# Altium project Carte_design.PrjPcb (part 2 of 2)

## Sheet WAN.SchDoc
size A4
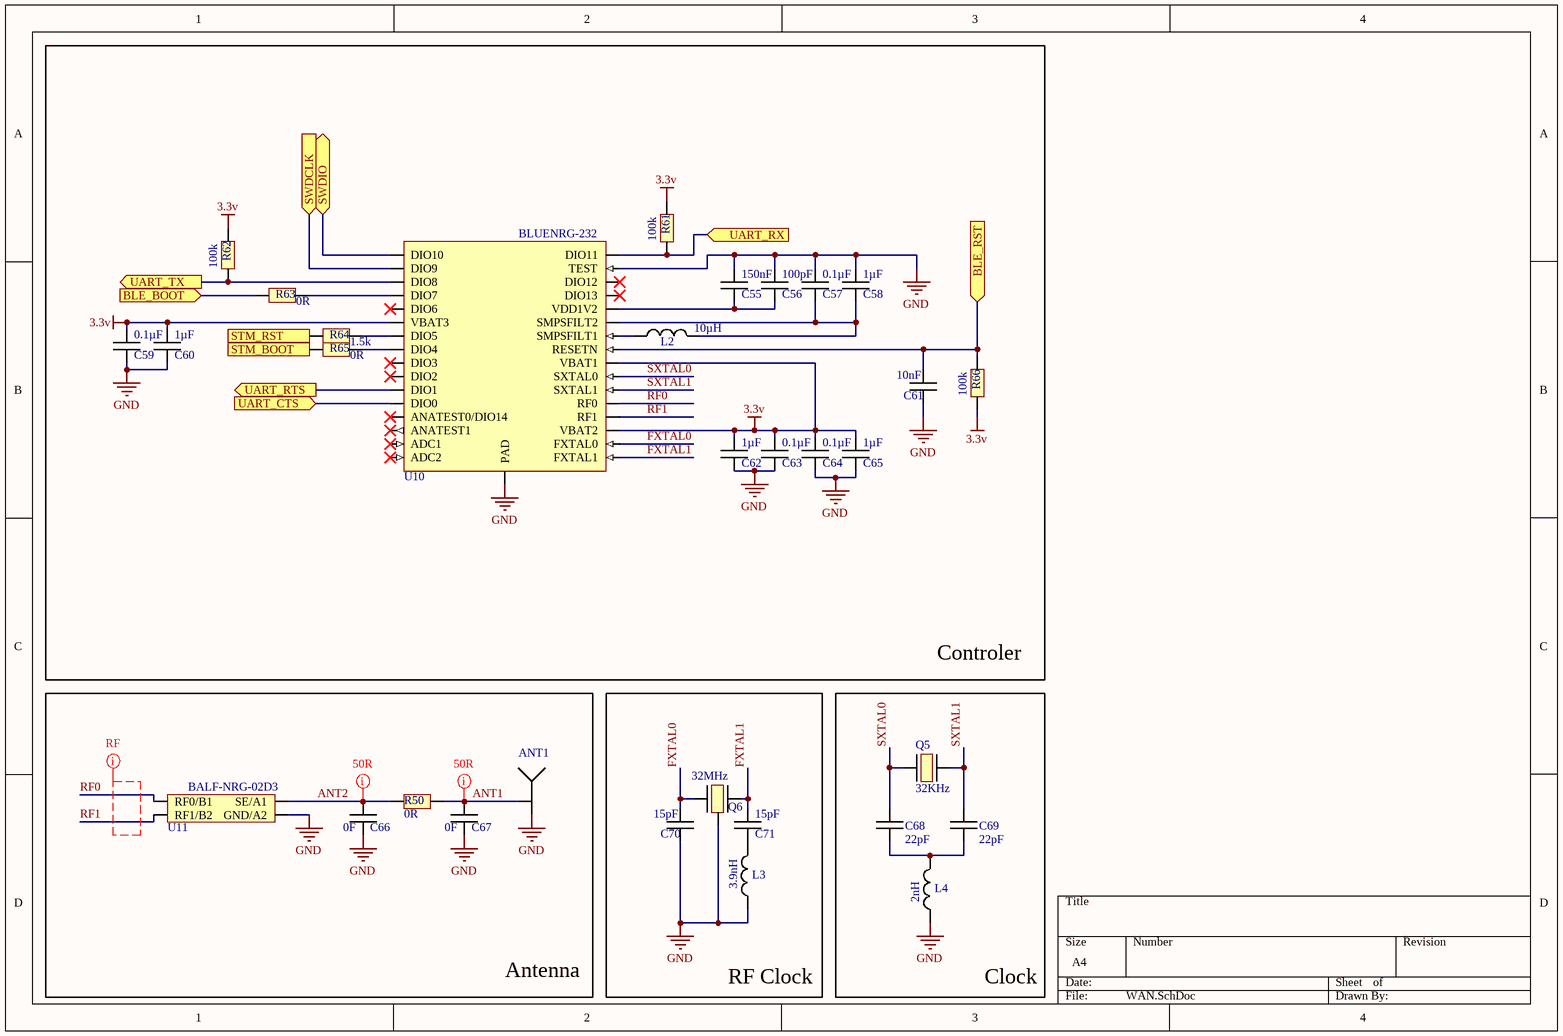
[diagram p4: WAN.SchDoc]

### Parts
ANT1  UFL  [UFL]  (value not drawn)
C55  150nF  [0603]
C56  100pF  [0603]
C57  0.1µF  [0603]
C58  1µF  [0603]
C59  0.1µF  [0603]
C60  1µF  [0603]
C61  10nF  [0603]
C62  1µF  [0603]
C63  0.1µF  [0603]
C64  0.1µF  [0603]
C65  1µF  [0603]
C66  0F  [0603]
C67  0F  [0603]
C68  22pF  [0603]
C69  22pF  [0603]
C70  15pF  [0603]
C71  15pF  [0603]
L2  10µH  [0603]
L3  3.9nH  [0402]
L4  2nH  [0603]
Q5  32KHz  [BLE_Quartz_Sxtal]
Q6  32MHz  [BLE_Quartz_Fxtal]
R50  0R  [0603]
R61  100k  [0603]
R62  100k  [0603]
R63  0R  [0603]
R64  1.5k  [0603]
R65  0R  [0603]
R66  100k  [0603]
U10  BLUENRG-232  [QFN50P500X500X100_HS-33M]
U11  BALF-NRG-02D3  [4-UFBGA]

### Blocks framed on the sheet
Controler: C55-C65 L2 R61-R66 U10
Antenna: ANT1 C66 C67 R50 U11
RF Clock: C70 C71 L3 Q6
Clock: C68 C69 L4 Q5

### Ports
BLE_BOOT (in), BLE_RST (in), STM_BOOT (out), STM_RST (out), SWDCLK (in), SWDIO (bidir), UART_CTS (in), UART_RTS (out), UART_RX (in), UART_TX (out)

### Nets
3.3v: C59.2 C60.2 C62.2 C63.2 C64.2 C65.2 R61.2 R62.2 R66.1 U10.6(VBAT3) U10.19(VBAT2) U10.24(VBAT1)
GND: ANT1.2(GND) C55.2 C56.2 C57.2 C58.2 C59.1 C60.1 C61.1 C62.1 C63.1 C64.1 C65.1 C66.1 C67.1 C70.1 L3.1 L4.1 Q6.3 U10.31(TEST) U10.33(PAD) U11.2(GND/A2)
ANT1: ANT1.1(GND) C67.2 R50.2
ANT2: C66.2 R50.1 U11.1(SE/A1)
FXTAL0: C70.2 Q6.1 U10.18(FXTAL0)
FXTAL1: C71.2 Q6.2 U10.17(FXTAL1)
RF0: U10.21(RF0) U11.3(RF0/B1)
RF1: U10.20(RF1) U11.4(RF1/B2)
RST1: R64.2 ; port STM_RST
RST2: C61.2 R66.2 U10.25(RESETN) ; port BLE_RST
SWCLK2: U10.2(DIO9) ; port SWDCLK
SWDIO2: U10.1(DIO10) ; port SWDIO
SXTAL0: C68.2 Q5.2 U10.23(SXTAL0)
SXTAL1: C69.2 Q5.1 U10.22(SXTAL1)
NetC55_1: C55.1 C56.1 U10.28(VDD1V2)
NetC57_1: C57.1 C58.1 L2.2 U10.27(SMPSFILT2)
NetC68_1: C68.1 C69.1 L4.2
NetC71_1: C71.1 L3.2
NetL2_1: L2.1 U10.26(SMPSFILT1)
NetR61_1: R61.1 U10.32(DIO11) ; port UART_RX
NetR62_1: R62.1 U10.3(DIO8) ; port UART_TX
NetR63_1: R63.1 U10.4(DIO7)
NetR63_2: R63.2 ; port BLE_BOOT
NetR64_1: R64.1 U10.7(DIO5)
NetR65_1: R65.1 U10.8(DIO4)
NetR65_2: R65.2 ; port STM_BOOT
NetU10_11: U10.11(DIO1) ; port UART_RTS
NetU10_12: U10.12(DIO0) ; port UART_CTS

Not connected (* = marked no-connect by the designer): U10 5(DIO6)* 9(DIO3)* 10(DIO2)* 13(ANATEST0/DIO14)* 14(ANATEST1)* 15(ADC1)* 16(ADC2)* 29(DIO13)* 30(DIO12)*

### Layout directives
rule Length Constraint [Min Length = 0.7mm    Max Length = 0.9mm]: (no net found under the mark)
rule Width Constraint [Pref Width = 0.25mm    Min Width = 0.25mm    Max Width = 0.25mm]; rule Clearance Constraint [Clearance = 0.2mm]; net class 50R: ANT1, ANT2

### Library data of the parts
ANT1 = UFL: Manufacturer 1: Hirose; Manufacturer Part Number 1: U.FL-R-SMT-1(40); Body Material: Bronze; Body Plating: Silver; Dielectric Material: Polymer; Impedance: 50R; Connector Type: Coaxial,Receptacle,Male Pin; Max Frequency: 6GHz; Polarity: Standard; Insulation Resistance: 500MR; Gender: Female; Supplier 1: Mouser; Stock 1: 562; Pricing 1: 1=1,14000, 10=0,93600, 100=0,85900, 250=0,78000, 500=0,71600, 1000=0,62400, 4000=0,54600, 8000=0,50800 (USD); RoHS: Yes; Mount: Surface Mount; Contact Material: Brass,Bronze; Contact Plating: Gold; Housing Color: Beige; Min Operating Temperature: -40°C; Max Operating Temperature: 90°C; Package Quantity: 4000; Packaging: Tape and Reel; Fastening Type: Snap; Termination: Solder; Frequency: 6GHz; Orientation: Vertical; Lead Free: Lead Free; ComponentLink1URL: https://datasheet.ciiva.com/18563/uflseries-18563675.pdf?src-supplier=Digi-Key; ComponentLink1Description: https://datasheet.ciiva.com/18563/uflseries-18563675.pdf?src-supplier=Digi-Key; Supplier Part Number 1: 798-UFLRSMT140
C55-C71 = Capa
L2 = Self: Manufacturer 1: TDK; Manufacturer Part Number 1: MLZ1608M100WT; Core Material: Ferrite; Tolerance: 20%; Self Resonant Frequency: 17MHz; Shielding: Shielded; Inductance: 10uH; Max DC Current: 250mA; DC Resistance (DCR): 1.05R; Test Frequency: 2MHz; DC Current: 90mA; Supplier 1: Farnell; Supplier Part Number 1: 2215635; Stock 1: 796; Pricing 1: 10=0,13600, 100=0,09360, 500=0,07170, 1000=0,05980, 2000=0,05180, 4000=0,04090, 20000=0,03940 (EUR); RoHS: Yes; Mount: Surface Mount; Case/Package: 603; Case Code (Metric): 1608; Case Code (Imperial): 0603; Min Operating Temperature: -55°C; Max Operating Temperature: 125°C; Packaging: Cut Tape; Inductance Tolerance: 20%; Military Standard: Not; Length: 1.75mm; Depth: 0.95mm; REACH SVHC: No SVHC; ComponentLink1URL: https://datasheet.ciiva.com/8045/1649095-8045526.pdf?src-supplier=Element14; ComponentLink1Description: https://datasheet.ciiva.com/8045/1649095-8045526.pdf?src-supplier=Element14
L3 = self2: Manufacturer 1: Murata; Manufacturer Part Number 1: LQG15WZ3N9S02D; Core Material: Air; Current Rating: 900mA; Shielding: Unshielded; DC Resistance (DCR): 90mR; Self Resonant Frequency: 5GHz; Test Frequency: 100MHz; Supplier 1: Digi-Key; Supplier Part Number 1: 490-15282-1-ND; Stock 1: 7036; Pricing 1: 1=0,15000, 10=0,13500, 100=0,08970, 500=0,07476, 1000=0,06279, 2500=0,05382 (USD); RoHS: No; Mount: Surface Mount; Case/Package: 0402; Case Code (Imperial): 0402; Case Code (Metric): 1005; Min Operating Temperature: -55°C; Max Operating Temperature: 125°C; Packaging: Cut Tape; Inductance: 3.9nH; Ratings: AEC-Q200; ComponentLink1URL: http://search.murata.co.jp/Ceramy/image/img/P02/JELF243B-9117.pdf?src-supplier=Digi-Key; ComponentLink1Description: http://search.murata.co.jp/Ceramy/image/img/P02/JELF243B-9117.pdf?src-supplier=Digi-Key
L4 = Self: Manufacturer 1: Murata; Manufacturer Part Number 1: BLM18GG471SN1D; Core Material: Ferrite; Material: Steel,Ferrite; Max Current Rating: 200mA; Impedance: 470R; Tolerance: 25%; Number of Lines: 1; Resistance: 1.3R; DC Resistance (DCR): 300mR; Test Frequency: 100MHz; Supplier 1: Digi-Key; Supplier Part Number 1: 490-5981-1-ND; Stock 1: 23621; Pricing 1: 1=0,27000, 10=0,20600, 25=0,17080, 50=0,14740, 100=0,13270, 250=0,11204, 500=0,10024, 1000=0,08549 (USD); RoHS: Yes; Case/Package: 0603; Number of Pins: 2; Case Code (Metric): 1608; Case Code (Imperial): 0603; Contact Plating: Tin,Matte; Min Operating Temperature: -55°C; Max Operating Temperature: 125°C; Package Quantity: 1; Packaging: Tape and Reel; Current Rating: 200mA; Max DC Current: 200mA; Termination: Flat; Number of Circuits: 1; Length: 1.6mm; Height: 0.8mm; Width: 0.8mm; Depth: 0.8mm; REACH SVHC: No SVHC; Lead Free: Lead Free; ComponentLink1URL: https://datasheet.ciiva.com/3067/l0110s0105blm18g-3067184.pdf?src-supplier=Avnet; ComponentLink1Description: https://datasheet.ciiva.com/3067/l0110s0105blm18g-3067184.pdf?src-supplier=Avnet; ComponentLink2URL: https://datasheet.ciiva.com/11800/0900766b811b5866-11800884.pdf?src-supplier=RSComponents; ComponentLink2Description: https://datasheet.ciiva.com/11800/0900766b811b5866-11800884.pdf?src-supplier=RSComponents; ComponentLink3URL: https://datasheet.ciiva.com/1467/5170-1467240.pdf?src-supplier=Element14; ComponentLink3Description: https://datasheet.ciiva.com/1467/5170-1467240.pdf?src-supplier=Element14; ComponentLink4URL: https://datasheet.ciiva.com/27747/1844951-27747823.pdf?src-supplier=Jameco; ComponentLink4Description: https://datasheet.ciiva.com/27747/1844951-27747823.pdf?src-supplier=Jameco; ComponentLink5URL: https://datasheet.ciiva.com/41449/001171701-da-01-en-chip-drossel0603-470r-200ma-1-6x0-8mm-41449377.pdf?src-supplier=Conrad; ComponentLink5Description: https://datasheet.ciiva.com/41449/001171701-da-01-en-chip-drossel0603-470r-200ma-1-6x0-8mm-41449377.pdf?src-supplier=Conrad; ComponentLink6URL: https://datasheet.ciiva.com/41449/001172271-da-01-en-drossel-0603-470r-1-6x0-8mm-4000st-41449611.pdf?src-supplier=Conrad; ComponentLink6Description: https://datasheet.ciiva.com/41449/001172271-da-01-en-drossel-0603-470r-1-6x0-8mm-4000st-41449611.pdf?src-supplier=Conrad; ComponentLink7URL: https://datasheet.ciiva.com/6211/l0110e-6211878.pdf?src-supplier=Digi-Key; ComponentLink7Description: https://datasheet.ciiva.com/6211/l0110e-6211878.pdf?src-supplier=Digi-Key; ComponentLink8URL: https://datasheet.ciiva.com/6211/l0110e-6211879.pdf?src-supplier=Digi-Key; ComponentLink8Description: https://datasheet.ciiva.com/6211/l0110e-6211879.pdf?src-supplier=Digi-Key; ComponentLink9URL: https://datasheet.ciiva.com/14122/blm-series-eng-tds-14122875.pdf?src-supplier=Distrelec; ComponentLink9Description: https://datasheet.ciiva.com/14122/blm-series-eng-tds-14122875.pdf?src-supplier=Distrelec
Q5 = BLE_quartz_Sxtal: Manufacturer 1: NDK; Manufacturer Part Number 1: NX2012SA-32.768K-STD-MUB-1; Frequency: 32.768kHz; Load Capacitance: 12.5pF; ESR (Equivalent Series Resistance): 80kR; Frequency Tolerance: 20ppm; Supplier 1: Digi-Key; Stock 1: 28609; Pricing 1: 1=0,91000, 10=0,80500, 50=0,75200, 100=0,66460, 500=0,62964, 1000=0,52470 (USD); RoHS: Yes; Mount: Surface Mount; Case/Package: SMD/SMT; Min Operating Temperature: -40°C; Max Operating Temperature: 85°C; Packaging: Tape and Reel; Length: 0.081inch; Height: 0.024inch; Width: 0.047inch; ComponentLink1URL: http://www.ndk.com/images/products/catalog/c_NX2012SA-STD-MUB-1_e.pdf?src-supplier=Digi-Key; ComponentLink1Description: http://www.ndk.com/images/products/catalog/c_NX2012SA-STD-MUB-1_e.pdf?src-supplier=Digi-Key; Supplier Part Number 1: 644-1219-1-ND
Q6 = BLE_Quartz_Fxtal: Manufacturer 1: Kyocera AVX; Manufacturer Part Number 1: CX2016DB32000D0FLJCC; Load Capacitance: 8pF; ESR (Equivalent Series Resistance): 80R; Frequency Tolerance: 10ppm; Frequency Stability: 15ppm; Supplier 1: Digi-Key; Stock 1: 89937; Pricing 1: 1=0,94000, 10=0,83500, 50=0,78040, 100=0,68970, 500=0,65340, 1000=0,54450 (USD); RoHS: Yes; Mount: Surface Mount; Case/Package: SMD/SMT; Number of Pins: 4; Min Operating Temperature: -30°C; Max Operating Temperature: 85°C; Frequency: 32MHz; Packaging: Tape and Reel; Package Quantity: 3000; Tolerance: 10ppm; Termination: SMD/SMT; Series Resistance: 80R; Length: 0.079inch; Height: 0.018inch; Width: 1.6mm; Lead Pitch: 1.4mm; REACH SVHC: No SVHC; ComponentLink1URL: https://datasheet.ciiva.com/29631/cx2016db-wl-e-29631269.pdf?src-supplier=Digi-Key; ComponentLink1Description: https://datasheet.ciiva.com/29631/cx2016db-wl-e-29631269.pdf?src-supplier=Digi-Key; ComponentLink2URL: https://datasheet.ciiva.com/29631/cx2016db-wl-e-29631270.pdf?src-supplier=Digi-Key; ComponentLink2Description: https://datasheet.ciiva.com/29631/cx2016db-wl-e-29631270.pdf?src-supplier=Digi-Key; ComponentLink3URL: https://datasheet.ciiva.com/29631/cx2016db-wl-e-29631271.pdf?src-supplier=Digi-Key; ComponentLink3Description: https://datasheet.ciiva.com/29631/cx2016db-wl-e-29631271.pdf?src-supplier=Digi-Key; Supplier Part Number 1: 1253-1118-1-ND
R50 R61-R66 = Resistance
U10 = BLUENRG-232: Manufacturer 1: STMicroelectronics; Supplier 1: Farnell; Manufacturer Part Number 1: BLUENRG-232; Stock 1: 3489; Pricing 1: 1=3,54000, 10=2,68000, 25=2,55000, 50=2,44000, 100=2,32000, 250=2,20000, 500=1,98000, 1000=1,64000 (EUR); RoHS: No; ComponentLink1URL: http://www.farnell.com/datasheets/2327324.pdf?src-supplier=Farnell; ComponentLink1Description: http://www.farnell.com/datasheets/2327324.pdf?src-supplier=Farnell; ComponentLink2URL: https://www.st.com/resource/en/flyer/flbluenrg21017.pdf?src-supplier=Digi-Key; ComponentLink2Description: https://www.st.com/resource/en/flyer/flbluenrg21017.pdf?src-supplier=Digi-Key; ComponentLink3URL: http://www.farnell.com/datasheets/2327324.pdf?src-supplier=Newark; ComponentLink3Description: http://www.farnell.com/datasheets/2327324.pdf?src-supplier=Newark; Supplier Part Number 1: 2771347
U11 = Balf: Manufacturer 1: STMicroelectronics; Supplier 1: Digi-Key; Manufacturer Part Number 1: BALF-NRG-02D3; Stock 1: 10182; Pricing 1: 1=0,40000, 10=0,34700, 100=0,25870, 500=0,20328, 1000=0,15708 (USD); RoHS: No; ComponentLink1URL: http://www.farnell.com/datasheets/2342732.pdf?src-supplier=Farnell; ComponentLink1Description: http://www.farnell.com/datasheets/2342732.pdf?src-supplier=Farnell; ComponentLink2URL: http://www.st.com/content/ccc/resource/technical/document/datasheet/group3/51/4f/c4/19/79/13/4a/ad/DM00408204/files/DM00408204.pdf/jcr:content/translations/en.DM00408204.pdf?src-supplier=Digi-Key; ComponentLink2Description: http://www.st.com/content/ccc/resource/technical/document/datasheet/group3/51/4f/c4/19/79/13/4a/ad/DM00408204/files/DM00408204.pdf/jcr:content/translations/en.DM00408204.pdf?src-supplier=Digi-Key; ComponentLink3URL: http://www.farnell.com/datasheets/2342732.pdf?src-supplier=Newark; ComponentLink3Description: http://www.farnell.com/datasheets/2342732.pdf?src-supplier=Newark; Supplier Part Number 1: 497-17591-1-ND

## Sheet Micro.SchDoc
size A4
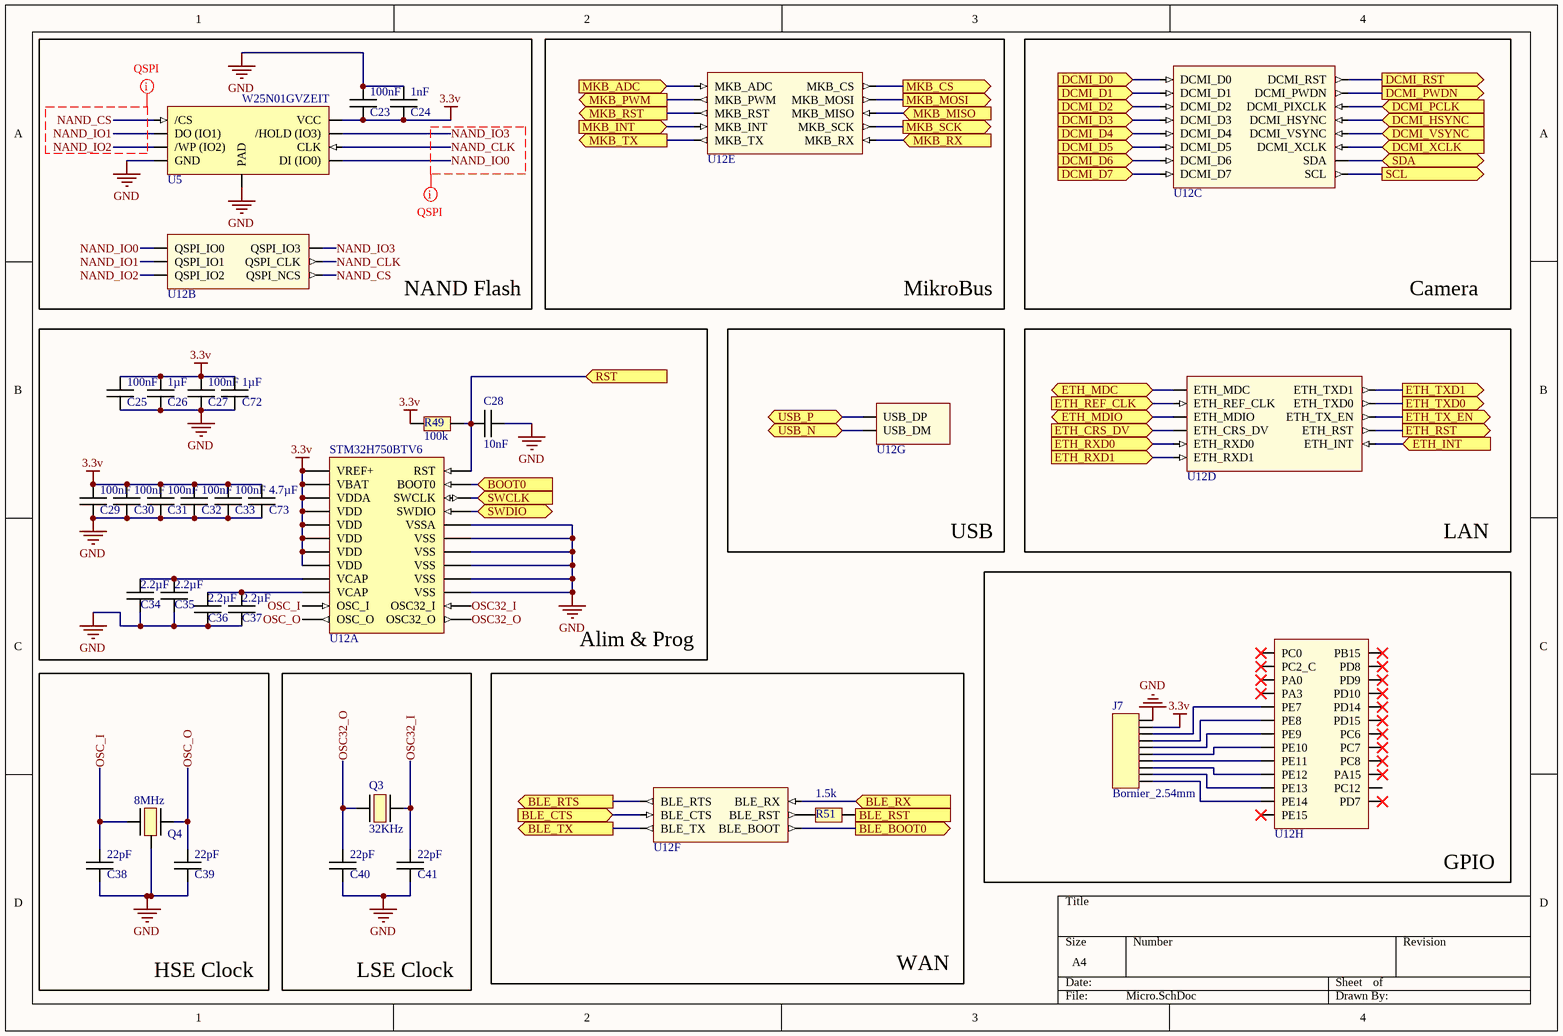
[diagram p5: Micro.SchDoc]

### Parts
C23  100nF  [0603]
C24  1nF  [0603]
C25  100nF  [0603]
C26  1µF  [0603]
C27  100nF  [0603]
C28  10nF  [0603]
C29  100nF  [0603]
C30  100nF  [0603]
C31  100nF  [0603]
C32  100nF  [0603]
C33  100nF  [0603]
C34  2.2µF  [0603]
C35  2.2µF  [0603]
C36  2.2µF  [0603]
C37  2.2µF  [0603]
C38  22pF  [0603]
C39  22pF  [0603]
C40  22pF  [0603]
C41  22pF  [0603]
C72  1µF  [0603]
C73  4.7µF  [0603]
J7  Bornier_2.54mm  [GPIO_header]
Q3  32KHz  [BLE_Quartz_Sxtal]
Q4  8MHz  [Quartz_Micro_HF]
R49  100k  [0603]
R51  1.5k  [0603]
U5  W25N01GVZEIT  [SON127P800X80_HS-9M]
U12  STM32H750BTV6  [LQFP100_14x14_0.5pitch]  (parts A,B,C,D,E,F,G,H of 8)

### Blocks framed on the sheet
NAND Flash: C23 C24 U5 U12
MikroBus: U12
Camera: U12
Alim & Prog: C25-C37 C72 C73 R49 U12
USB: U12
LAN: U12
GPIO: J7 U12
HSE Clock: C38 C39 Q4
LSE Clock: C40 C41 Q3
WAN: R51 U12

### Ports
BLE_BOOT0 (out), BLE_CTS (in), BLE_RST (out), BLE_RTS (out), BLE_RX (in), BLE_TX (out), BOOT0 (in), DCMI_D0 (in), DCMI_D1 (in), DCMI_D2 (in), DCMI_D3 (in), DCMI_D4 (in), DCMI_D5 (in), DCMI_D6 (in), DCMI_D7 (in), DCMI_HSYNC (in), DCMI_PCLK (in), DCMI_PWDN (out), DCMI_RST (out), DCMI_VSYNC (in), DCMI_XCLK (in), ETH_CRS_DV (in), ETH_INT (in), ETH_MDC (bidir), ETH_MDIO (bidir), ETH_REF_CLK (in), ETH_RST (out), ETH_RXD0 (in), ETH_RXD1 (in), ETH_TX_EN (out), ETH_TXD0 (out), ETH_TXD1 (out), MKB_ADC (in), MKB_CS (out), MKB_INT (in), MKB_MISO (in), MKB_MOSI (out), MKB_PWM (out), MKB_RST (out), MKB_RX (in), MKB_SCK (out), MKB_TX (out), RST (in), SCL (out), SDA (bidir), SWCLK (in), SWDIO (bidir), USB_N (bidir), USB_P (bidir)

### Nets
3.3v: C23.1 C24.1 C25.2 C26.2 C27.2 C29.2 C30.2 C31.2 C32.2 C33.2 C72.2 C73.2 J7.9 R49.2 U5.8(VCC) U12.6(VBAT) U12.11(VDD) U12.20(VREF+) U12.21(VDDA) U12.27(VDD) U12.50(VDD) U12.75(VDD) U12.100(VDD)
GND: C23.2 C24.2 C25.1 C26.1 C27.1 C28.1 C29.1 C30.1 C31.1 C32.1 C33.1 C34.1 C35.1 C36.1 C37.1 C38.1 C39.1 C40.1 C41.1 C72.1 C73.1 J7.10 Q4.3 U5.4(GND) U5.9(PAD) U12.10(VSS) U12.19(VSSA) U12.26(VSS) U12.49(VSS) U12.74(VSS) U12.99(VSS)
CRS: U12.31(ETH_CRS_DV) ; port ETH_CRS_DV
INT: U12.34(ETH_INT) ; port ETH_INT
MDC: U12.16(ETH_MDC) ; port ETH_MDC
MDIO: U12.24(ETH_MDIO) ; port ETH_MDIO
NAND_CLK: U5.6(CLK) U12.36(QSPI_CLK)
NAND_CS: U5.1(/CS) U12.46(QSPI_NCS)
NAND_IO0: U5.5(DI_(IO0)) U12.66(QSPI_IO0)
NAND_IO1: U5.2(DO_(IO1)) U12.59(QSPI_IO1)
NAND_IO2: U5.3(/WP_(IO2)) U12.1(QSPI_IO2)
NAND_IO3: U5.7(/HOLD_(IO3)) U12.60(QSPI_IO3)
OSC32_I: C41.2 Q3.1 U12.8(OSC32_I)
OSC32_O: C40.2 Q3.2 U12.9(OSC32_O)
OSC_I: C38.2 Q4.1 U12.12(OSC_I)
OSC_O: C39.2 Q4.2 U12.13(OSC_O)
REF_CLK: U12.23(ETH_REF_CLK) ; port ETH_REF_CLK
RST1: C28.2 R49.1 U12.14(RST) ; port RST
RST2: R51.1 ; port BLE_RST
RXD0: U12.51(ETH_TXD0) ; port ETH_TXD0
RXD1: U12.52(ETH_TXD1) ; port ETH_TXD1
SWCLK1: U12.76(SWCLK) ; port SWCLK
SWDIO1: U12.72(SWDIO) ; port SWDIO
TXD0: U12.32(ETH_RXD0) ; port ETH_RXD0
TXD1: U12.33(ETH_RXD1) ; port ETH_RXD1
TXEN: U12.47(ETH_TX_EN) ; port ETH_TX_EN
USB_COM_N: U12.70(USB_DM) ; port USB_N
USB_COM_P: U12.71(USB_DP) ; port USB_P
NetC34_2: C34.2 C35.2 U12.48(VCAP)
NetC36_2: C36.2 C37.2 U12.73(VCAP)
NetD3_2: U12.35(ETH_RST) ; port ETH_RST
NetJ2_3: U12.95(SCL) ; port SCL
NetJ2_4: U12.96(SDA) ; port SDA
NetJ2_8: U12.29(DCMI_XCLK) ; port DCMI_XCLK
NetJ2_17: U12.2(DCMI_RST) ; port DCMI_RST
NetJ2_18: U12.7(DCMI_PWDN) ; port DCMI_PWDN
NetJ7_1: J7.1 U12.44(PE14)
NetJ7_2: J7.2 U12.43(PE13)
NetJ7_3: J7.3 U12.42(PE12)
NetJ7_4: J7.4 U12.41(PE11)
NetJ7_5: J7.5 U12.40(PE10)
NetJ7_6: J7.6 U12.39(PE9)
NetJ7_7: J7.7 U12.38(PE8)
NetJ7_8: J7.8 U12.37(PE7)
NetMIKROBUS_1_1: U12.18(MKB_ADC) ; port MKB_ADC
NetMIKROBUS_1_2: U12.83(MKB_RST) ; port MKB_RST
NetMIKROBUS_1_3: U12.85(MKB_CS) ; port MKB_CS
NetMIKROBUS_1_4: U12.89(MKB_SCK) ; port MKB_SCK
NetMIKROBUS_1_5: U12.90(MKB_MISO) ; port MKB_MISO
NetMIKROBUS_1_6: U12.91(MKB_MOSI) ; port MKB_MOSI
NetMIKROBUS_1_13: U12.87(MKB_RX) ; port MKB_RX
NetMIKROBUS_1_14: U12.86(MKB_TX) ; port MKB_TX
NetMIKROBUS_1_15: U12.84(MKB_INT) ; port MKB_INT
NetMIKROBUS_1_16: U12.67(MKB_PWM) ; port MKB_PWM
NetR19_1: U12.93(DCMI_VSYNC) ; port DCMI_VSYNC
NetR20_2: U12.28(DCMI_HSYNC) ; port DCMI_HSYNC
NetR21_1: U12.30(DCMI_PIXCLK) ; port DCMI_PCLK
NetR22_1: U12.5(DCMI_D7) ; port DCMI_D7
NetR23_2: U12.4(DCMI_D6) ; port DCMI_D6
NetR24_1: U12.92(DCMI_D5) ; port DCMI_D5
NetR25_2: U12.3(DCMI_D4) ; port DCMI_D4
NetR26_1: U12.98(DCMI_D3) ; port DCMI_D3
NetR27_2: U12.97(DCMI_D2) ; port DCMI_D2
NetR28_1: U12.69(DCMI_D1) ; port DCMI_D1
NetR29_2: U12.68(DCMI_D0) ; port DCMI_D0
NetR51_2: R51.2 U12.82(BLE_RST)
NetR61_1: U12.78(BLE_TX) ; port BLE_TX
NetR62_1: U12.79(BLE_RX) ; port BLE_RX
NetR63_2: U12.81(BLE_BOOT) ; port BLE_BOOT0
NetR65_2: U12.94(BOOT0) ; port BOOT0
NetU10_11: U12.58(BLE_CTS) ; port BLE_CTS
NetU10_12: U12.53(BLE_RTS) ; port BLE_RTS

Not connected (* = marked no-connect by the designer): U12 15(PC0)* 17(PC2_C)* 22(PA0)* 25(PA3)* 45(PE15)* 54(PB15)* 55(PD8)* 56(PD9)* 57(PD10)* 61(PD14)* 62(PD15)* 63(PC6)* 64(PC7)* 65(PC8)* 77(PA15)* 80(PC12) 88(PD7)*

### Layout directives
rule Matched Net Lengths [Tolerance = 2mm]; net class QSPI: NAND_CLK, NAND_CS, NAND_IO0, NAND_IO1, NAND_IO2, NAND_IO3

### Library data of the parts
C23-C41 C72 C73 = Capa
J7 = GPIO_bornier: Manufacturer 1: Multicomp; Manufacturer Part Number 1: 2212S-10SG-85; Description: MULTICOMP         2212S-10SG-85            Board-To-Board Connector, 2212S Series, Through Hole, Receptacle, 10 Contacts, 2.54 mm; Gender: Receptacle; Number of Contacts: 10; Insulation Resistance: 1GR; Supplier 1: Farnell; Stock 1: 33107; Pricing 1: 5=0,22700, 50=0,16700, 150=0,14500, 250=0,11700, 500=0,11300, 1500=0,10900, 2500=0,10500, 5000=0,10100 (EUR); RoHS: Yes; Mount: Through Hole; Weight: 0.11lb; Contact Plating: Gold; Contact Material: Copper Alloy; Number of Rows: 1; Termination: Through Hole; Length: 1.02inch; Height: 0.35inch; Width: 0.12inch; REACH SVHC: No SVHC; Flammability Rating: UL94 V-0; ComponentLink1URL: https://datasheet.ciiva.com/1434/1662126-1434006.pdf?src-supplier=Element14; ComponentLink1Description: https://datasheet.ciiva.com/1434/1662126-1434006.pdf?src-supplier=Element14; Supplier Part Number 1: 1593464
Q3 = BLE_quartz_Sxtal: as Q5 on sheet WAN; Supplier 1: Digi-Key; Stock 1: 28609; Pricing 1: 1=0,91000, 10=0,80500, 50=0,75200, 100=0,66460, 500=0,62964, 1000=0,52470 (USD); RoHS: Yes; Mount: Surface Mount; Case/Package: SMD/SMT; Min Operating Temperature: -40°C; Max Operating Temperature: 85°C; Packaging: Tape and Reel; Length: 0.081inch; Height: 0.024inch; Width: 0.047inch; ComponentLink1URL: http://www.ndk.com/images/products/catalog/c_NX2012SA-STD-MUB-1_e.pdf?src-supplier=Digi-Key; ComponentLink1Description: http://www.ndk.com/images/products/catalog/c_NX2012SA-STD-MUB-1_e.pdf?src-supplier=Digi-Key; Supplier Part Number 1: 644-1219-1-ND
Q4 = Quartz_micro_HF: Manufacturer 1: Multicomp; Manufacturer Part Number 1: MCSJK-7I-8.00-10-10-60-B-10; Supplier 1: Farnell; Stock 1: 955; Pricing 1: 1=0,42000, 50=0,33900, 100=0,31500, 250=0,30400, 500=0,28100, 1000=0,25400, 5000=0,24900 (EUR); RoHS: No; ComponentLink1URL: http://www.farnell.com/datasheets/2608078.pdf?src-supplier=Farnell; ComponentLink1Description: http://www.farnell.com/datasheets/2608078.pdf?src-supplier=Farnell; Supplier Part Number 1: 2854010
R49 R51 = Resistance
U5 = W25N01GVZEIT: Manufacturer 1: Winbond; Supplier 1: Arrow; Manufacturer Part Number 1: W25N01GVZEIT; Stock 1: 984; Pricing 1: 1=2,30400, 10=2,07800, 25=2,03300, 50=2,00590, 100=1,79100, 250=1,72200, 500=1,69700, 1000=1,57900, 5000=1,41900 (USD); RoHS: No; Supplier Part Number 1: W25N01GVZEIT
U12 = STM32H750BTV6: Manufacturer 1: STMicroelectronics; Manufacturer Part Number 1: STM32H750VBT6; Interface: I2C,SPI,Ethernet,IrDA,MMC,SDIO,SD,UART,EBI/EMI; Peripherals: Brown-out Detect/Reset,POR,PWM,WDT,DMA,LCD; Memory Type: FLASH; Core Architecture: ARM; Frequency: 480MHz; Number of I/Os: 82; Memory Size: 128KB; Oscillator Type: Internal; Supplier 1: Farnell; Stock 1: 690; Pricing 1: 1=7,35000, 10=6,08000, 25=5,79000, 50=5,42000, 100=5,04000, 250=4,80000, 500=3,81000 (EUR); RoHS: No; Mount: Surface Mount; Case/Package: LQFP; Min Operating Temperature: -40°C; Max Operating Temperature: 85°C; Packaging: Tray; ComponentLink1URL: http://www.farnell.com/datasheets/2710930.pdf?src-supplier=Farnell; ComponentLink1Description: http://www.farnell.com/datasheets/2710930.pdf?src-supplier=Farnell; ComponentLink2URL: https://www.st.com/resource/en/errata_sheet/dm00399555.pdf?src-supplier=Digi-Key; ComponentLink2Description: https://www.st.com/resource/en/errata_sheet/dm00399555.pdf?src-supplier=Digi-Key; ComponentLink3URL: http://www.farnell.com/datasheets/2710930.pdf?src-supplier=Element14; ComponentLink3Description: http://www.farnell.com/datasheets/2710930.pdf?src-supplier=Element14; ComponentLink4URL: http://www.farnell.com/datasheets/2710930.pdf?src-supplier=Newark; ComponentLink4Description: http://www.farnell.com/datasheets/2710930.pdf?src-supplier=Newark; Supplier Part Number 1: 2980947

## Sheet Debug.SchDoc
size A4
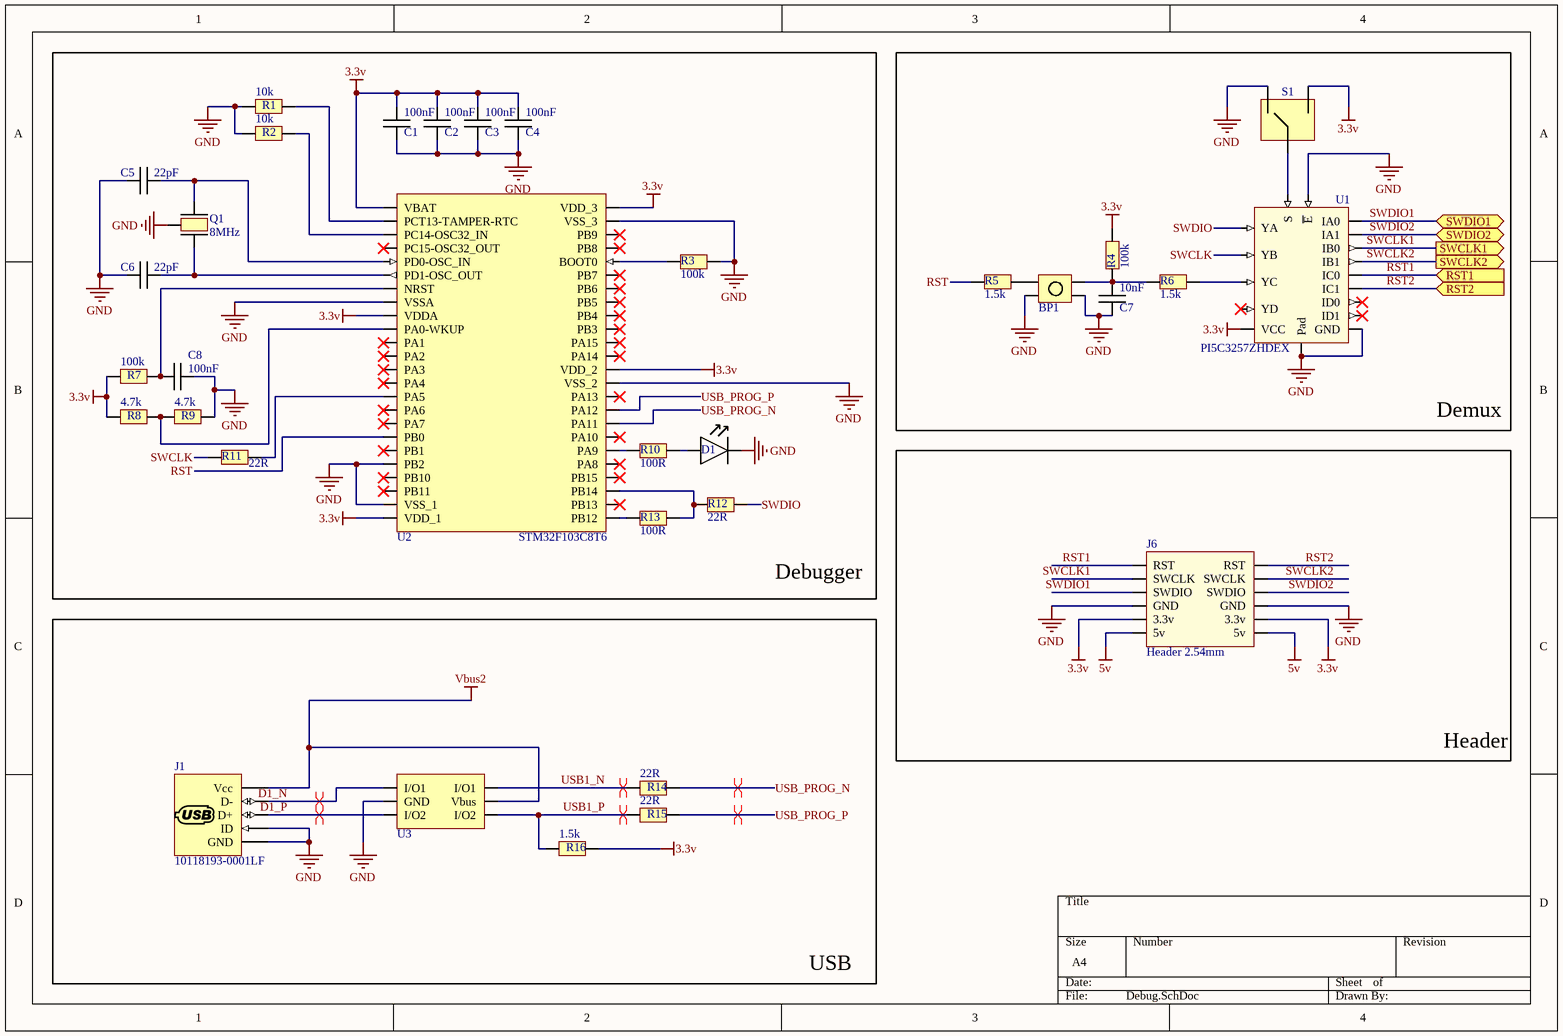
[diagram p6: Debug.SchDoc]

### Parts
BP1  BP  [BP]  (value not drawn)
C1  100nF  [0603]
C2  100nF  [0603]
C3  100nF  [0603]
C4  100nF  [0603]
C5  22pF  [0603]
C6  22pF  [0603]
C7  10nF  [0603]
C8  100nF  [0603]
D1  Led  [LED_0603]  (value not drawn)
J1  10118193-0001LF  [Mini_USB_mixte]
J6  Header 2.54mm  [Header_prog]
Q1  8MHz  [Quartz_prog]
R1  10k  [0603]
R2  10k  [0603]
R3  100k  [0603]
R4  100k  [0603]
R5  1.5k  [0603]
R6  1.5k  [0603]
R7  100k  [0603]
R8  4.7k  [0603]
R9  4.7k  [0603]
R10  100R  [0603]
R11  22R  [0603]
R12  22R  [0603]
R13  100R  [0603]
R14  22R  [0603]
R15  22R  [0603]
R16  1.5k  [0603]
S1  microswitch  [Switch_slider]  (value not drawn)
U1  PI5C3257ZHDEX  [QFN50P300X300X65_HS-17M]
U2  STM32F103C8T6  [CQFP50P900X900X160-48M]
U3  USBLC6-2P6  [SOT95P280X145-6M]  (value not drawn)

### Blocks framed on the sheet
Debugger: C1-C6 C8 D1 Q1 R1-R3 R7-R13 U2
Demux: BP1 C7 R4-R6 S1 U1
Header: J6
USB: J1 R14-R16 U3

### Ports
RST1 (in), RST2 (in), SWCLK1 (out), SWCLK2 (out), SWDIO1 (bidir), SWDIO2 (bidir)

### Nets
3.3v: C1.2 C2.2 C3.2 C4.2 J6.5(3.3v) J6.8(3.3v) R4.2 R7.1 R8.1 R16.2 S1.1(NO7) U1.16(VCC) U2.1(VBAT) U2.9(VDDA) U2.24(VDD_1) U2.36(VDD_2) U2.48(VDD_3)
5v: J6.6(5v) J6.7(5v)
GND: BP1.2(S) BP1.3(S) C1.1 C2.1 C3.1 C4.1 C5.1 C6.1 C7.1 C8.2 D1.2 J1.4(ID) J1.5(GND) J6.4(GND) J6.9(GND) Q1.3 R1.1 R2.1 R3.2 R9.2 S1.3(NO6) U1.8(GND) U1.15(~{E}) U1.17(Pad) U2.8(VSSA) U2.20(PB2) U2.23(VSS_1) U2.35(VSS_2) U2.47(VSS_3) U3.2(GND)
Vbus2: J1.1(Vcc) U3.5(Vbus)
D1_N: J1.2(D-) U3.1(I/O1)
D1_P: J1.3(D+) U3.3(I/O2)
RST: R5.2 U2.18(PB0)
RST1: J6.1(RST) U1.11(IC0) ; port RST1
RST2: J6.12(RST) U1.10(IC1) ; port RST2
SWCLK: R11.1 U1.7(YB)
SWCLK1: J6.2(SWCLK) U1.5(IB0) ; port SWCLK1
SWCLK2: J6.11(SWCLK) U1.6(IB1) ; port SWCLK2
SWDIO: R12.2 U1.4(YA)
SWDIO1: J6.3(SWDIO) U1.2(IA0) ; port SWDIO1
SWDIO2: J6.10(SWDIO) U1.3(IA1) ; port SWDIO2
USB1_N: R14.1 U3.6(I/O1)
USB1_P: R15.1 R16.1 U3.4(I/O2)
USB_PROG_N: R14.2 U2.32(PA11)
USB_PROG_P: R15.2 U2.33(PA12)
NetBP1_1: BP1.1(S) R5.1
NetBP1_4: BP1.4(S) C7.2 R4.1 R6.2
NetC5_2: C5.2 Q1.1 U2.5(PD0-OSC_IN)
NetC6_2: C6.2 Q1.2 U2.6(PD1-OSC_OUT)
NetC8_1: C8.1 R7.2 U2.7(NRST)
NetD1_1: D1.1 R10.2
NetR1_2: R1.2 U2.2(PCT13-TAMPER-RTC)
NetR2_2: R2.2 U2.3(PC14-OSC32_IN)
NetR3_1: R3.1 U2.44(BOOT0)
NetR6_1: R6.1 U1.9(YC)
NetR8_2: R8.2 R9.1 U2.10(PA0-WKUP)
NetR10_1: R10.1 U2.30(PA9)
NetR11_2: R11.2 U2.15(PA5)
NetR12_1: R12.1 R13.2 U2.27(PB14)
NetR13_1: R13.1 U2.25(PB12)
NetS1_2: S1.2(NO5) U1.1(S)

Not connected (* = marked no-connect by the designer): U1 12(YD)* 13(ID1)* 14(ID0)*; U2 4(PC15-OSC32_OUT)* 11(PA1)* 12(PA2)* 13(PA3)* 14(PA4)* 16(PA6)* 17(PA7)* 19(PB1)* 21(PB10)* 22(PB11)* 26(PB13)* 28(PB15)* 29(PA8)* 31(PA10)* 34(PA13)* 37(PA14)* 38(PA15)* 39(PB3)* 40(PB4)* 41(PB5)* 42(PB6)* 43(PB7)* 45(PB8)* 46(PB9)*

### Layout directives
differential pair; rule Differential Pairs Routing [Pref Gap = 0.25mm    Min Gap  = 0.25mm    Max Gap  = 0.25mmPref Width = 0.17mm    Min Width  = 0.17mm    Max Width  = 0.17mm]; net class USB_diff: D1_N, D1_P, USB1_N, USB1_P, USB_PROG_N, USB_PROG_P

### Library data of the parts
BP1 = BP: Manufacturer 1: Schurter; Manufacturer Part Number 1: 1241.1600.11; Mechanical Life: 1000000Cycles; Actuator Material: Polyphenylene; Current Rating: 50mA; Operating Force: 1.8N; Throw Configuration: SPST; Voltage Rating (DC): 42V; Voltage Rating (AC): 30V; Illumination Type: Non-Illuminated,Illuminated; Switch Travel: 0.35mm; Switch Function: Off-Mom; Actuator Type: Standard; Actuator Length: 1.05mm; Ratings: IP40; Supplier 1: Farnell; Stock 1: 75; Pricing 1: 1=1,74000, 50=1,68000, 100=1,27000, 500=1,09000, 1000=1,07000 (EUR); RoHS: Yes; Mount: Surface Mount; Weight: 0.059966oz; Contact Material: Gold; Contact Plating: Gold; Min Operating Temperature: -40°C; Max Operating Temperature: 85°C; Package Quantity: 100; Packaging: Bulk; Termination: Gull Wing; Max Current Rating: 50mA; Contact Current Rating: 50mA; Max Voltage Rating (DC): 42V; Max Voltage Rating (AC): 30V; Orientation: Straight; Length: 11.4mm; Depth: 15.9mm; Radiation Hardening: No; REACH SVHC: No SVHC; Flammability Rating: UL94 V-0; ComponentLink1URL: https://datasheet.ciiva.com/1223/typ-sms-1223568.pdf?src-supplier=Element14; ComponentLink1Description: https://datasheet.ciiva.com/1223/typ-sms-1223568.pdf?src-supplier=Element14; ComponentLink2URL: https://datasheet.ciiva.com/25603/0900766b81148c24-25603897.pdf?src-supplier=RSComponents; ComponentLink2Description: https://datasheet.ciiva.com/25603/0900766b81148c24-25603897.pdf?src-supplier=RSComponents; Supplier Part Number 1: 1217752
C1-C8 = Capa
D1 = Led: Manufacturer 1: Rohm; Manufacturer Part Number 1: SML-D12D8WT86C; Color: Orange; Lens Color: Colorless; Lens Style: Flat; Lens Transparency: Clear; Luminous Intensity: 100mcd; Forward Voltage: 2.2V; Test Current: 10mA; Dominant Wavelength: 605nm; Lens Size: 0.8mm; Supplier 1: Farnell; Supplier Part Number 1: 2687484; Stock 1: 9052; Pricing 1: 5=0,27600, 25=0,26700, 100=0,10800, 250=0,10100, 500=0,09420, 1000=0,05410 (EUR); RoHS: No; Mount: Surface Mount; Case/Package: 0603; Case Code (Imperial): 0603; Case Code (Metric): 1608; Packaging: Tape and Reel; Length: 1.6mm; Height: 0.65mm; Width: 0.8mm; ComponentLink1URL: http://www.farnell.com/datasheets/2186940.pdf?src-supplier=Farnell; ComponentLink1Description: http://www.farnell.com/datasheets/2186940.pdf?src-supplier=Farnell; ComponentLink2URL: https://www.rohm.com/datasheet/SML-D12D8W(C)/sml-d12x8(c)-e?src-supplier=Digi-Key; ComponentLink2Description: https://www.rohm.com/datasheet/SML-D12D8W(C)/sml-d12x8(c)-e?src-supplier=Digi-Key
J1 = 10118193-0001LF: CONN RCPT USB2.0 MICRO B SMD R/A; Manufacturer 1: Amphenol FCI; Gender: Female; Connector Type: USB,Receptacle; Number of Contacts: 5; Insulation Resistance: 1GR; Number of Ports: 1; Current Rating: 1.8A; Max Voltage Rating (AC): 100V; Pitch: 0.65mm; Supplier 1: Digi-Key; Manufacturer Part Number 1: 10118193-0001LF; Stock 1: 117828; Pricing 1: 1=0,43000, 10=0,40500, 25=0,36440, 50=0,32400, 100=0,31040, 250=0,28344, 500=0,26994 (USD); RoHS: Yes; Mount: Surface Mount,Horizontal; Contact Material: Copper Alloy; Contact Plating: Gold; Color: Black; Number of Terminals: 5; Housing Material: Polymer; Min Operating Temperature: -55°C; Max Operating Temperature: 85°C; Termination: Solder; Orientation: Right Angle; Package Quantity: 1200; Packaging: Tape and Reel; Voltage Rating: 100V; Features: Shielded; Length: 7.86mm; Depth: 5.67mm; Radiation Hardening: No; Flammability Rating: UL94 V-0; ComponentLink1URL: https://datasheet.ciiva.com/851/10118193-851106.pdf?src-supplier=Digi-Key; ComponentLink1Description: https://datasheet.ciiva.com/851/10118193-851106.pdf?src-supplier=Digi-Key; ComponentLink2URL: https://datasheet.ciiva.com/14802/10118193-0001lf-webpage-14802386.pdf?src-supplier=Arrow; ComponentLink2Description: https://datasheet.ciiva.com/14802/10118193-0001lf-webpage-14802386.pdf?src-supplier=Arrow; ComponentLink3URL: https://datasheet.ciiva.com/26853/getdatasheetpartid-418618-26853893.pdf?src-supplier=Verical; ComponentLink3Description: https://datasheet.ciiva.com/26853/getdatasheetpartid-418618-26853893.pdf?src-supplier=Verical; ComponentLink4URL: https://datasheet.ciiva.com/4598/10118193ac-197151-4598799.pdf?src-supplier=Mouser; ComponentLink4Description: https://datasheet.ciiva.com/4598/10118193ac-197151-4598799.pdf?src-supplier=Mouser; ComponentLink5URL: https://datasheet.ciiva.com/851/10118193-851107.pdf?src-supplier=Digi-Key; ComponentLink5Description: https://datasheet.ciiva.com/851/10118193-851107.pdf?src-supplier=Digi-Key; ComponentLink6URL: https://datasheet.ciiva.com/851/10118193-851108.pdf?src-supplier=Digi-Key; ComponentLink6Description: https://datasheet.ciiva.com/851/10118193-851108.pdf?src-supplier=Digi-Key; ComponentLink7URL: https://datasheet.ciiva.com/14618/70236827-14618887.pdf?src-supplier=Allied+Electronics; ComponentLink7Description: https://datasheet.ciiva.com/14618/70236827-14618887.pdf?src-supplier=Allied+Electronics; Supplier Part Number 1: 609-4616-1-ND
J6 = Header_prog: Manufacturer 1: Molex; Manufacturer Part Number 1: 90131-0126; Current Rating: 3A; Voltage Rating: 350V; Number of Positions: 12; Gender: Male; Supplier 1: Farnell; Stock 1: 578; Pricing 1: 1=1,13000, 5=1,08000, 10=0,93800, 50=0,89900, 100=0,57600, 500=0,55600, 1000=0,52900 (EUR); RoHS: Yes; Mount: Through Hole; Contact Plating: Tin; Contact Material: Brass; Housing Color: Black; Housing Material: Polyester; Min Operating Temperature: -55°C; Max Operating Temperature: 125°C; Number of Rows: 2; Packaging: Tray; Package Quantity: 2400; Termination: Solder; Number of Contacts: 12; Orientation: Straight; Lead Pitch: 2.54mm; Pitch: 2.54mm; Radiation Hardening: No; REACH SVHC: Unknown; Lead Free: Lead Free; ComponentLink1URL: https://datasheet.ciiva.com/11746/0900766b80d60386-11746641.pdf?src-supplier=RSComponents; ComponentLink1Description: https://datasheet.ciiva.com/11746/0900766b80d60386-11746641.pdf?src-supplier=RSComponents; ComponentLink2URL: https://datasheet.ciiva.com/10081/0901310126-pcb-headers-10081988.pdf?src-supplier=Avnet; ComponentLink2Description: https://datasheet.ciiva.com/10081/0901310126-pcb-headers-10081988.pdf?src-supplier=Avnet; ComponentLink3URL: https://datasheet.ciiva.com/30238/0901310126-pcb-headers-30238630.pdf?src-supplier=Onlinecomponents.com; ComponentLink3Description: https://datasheet.ciiva.com/30238/0901310126-pcb-headers-30238630.pdf?src-supplier=Onlinecomponents.com; ComponentLink4URL: https://datasheet.ciiva.com/5150/0901310126-pcb-headers-151523-5150855.pdf?src-supplier=Mouser; ComponentLink4Description: https://datasheet.ciiva.com/5150/0901310126-pcb-headers-151523-5150855.pdf?src-supplier=Mouser; ComponentLink5URL: https://datasheet.ciiva.com/16731/0901310126-pcb-headers-16731638.pdf?src-supplier=Avnet+Europe; ComponentLink5Description: https://datasheet.ciiva.com/16731/0901310126-pcb-headers-16731638.pdf?src-supplier=Avnet+Europe; ComponentLink6URL: https://datasheet.ciiva.com/26307/cgrid-iii-eng-tds-26307631.pdf?src-supplier=Distrelec; ComponentLink6Description: https://datasheet.ciiva.com/26307/cgrid-iii-eng-tds-26307631.pdf?src-supplier=Distrelec; Supplier Part Number 1: 3049397
Q1 = Quartz_8MHz: Manufacturer 1: Abracon; Manufacturer Part Number 1: ABMM2-8.000MHZ-E2-T; Frequency Tolerance: 20ppm; Load Capacitance: 18pF; ESR (Equivalent Series Resistance): 72R; Supplier 1: Farnell; Stock 1: 32000; Pricing 1: 1=0,80800, 50=0,55800, 100=0,52200, 250=0,47600, 500=0,47400, 1000=0,47100, 5000=0,46900 (EUR); RoHS: Yes; Case/Package: CSMD; Number of Pins: 4; Min Operating Temperature: -20°C; Max Operating Temperature: 70°C; Package Quantity: 1000; Frequency: 8MHz; Packaging: Tape and Reel; Frequency Stability: 20ppm; Tolerance: 20ppm; Termination: SMD/SMT; Composition: Ceramic; Series Resistance: 72R; Accuracy: 20ppm; Length: 6mm; Height: 0.047inch; Width: 3.6mm; Depth: 3.6mm; Lead Free: Lead Free; REACH SVHC: No SVHC; ComponentLink1URL: https://datasheet.ciiva.com/7998/1682206-7998656.pdf?src-supplier=Element14; ComponentLink1Description: https://datasheet.ciiva.com/7998/1682206-7998656.pdf?src-supplier=Element14; ComponentLink2URL: https://datasheet.ciiva.com/4945/abmm2-40161-4945441.pdf?src-supplier=Mouser; ComponentLink2Description: https://datasheet.ciiva.com/4945/abmm2-40161-4945441.pdf?src-supplier=Mouser; ComponentLink3URL: https://datasheet.ciiva.com/3176/abmm2-3176155.pdf?src-supplier=Avnet; ComponentLink3Description: https://datasheet.ciiva.com/3176/abmm2-3176155.pdf?src-supplier=Avnet; ComponentLink4URL: https://datasheet.ciiva.com/855/abmm2-855405.pdf?src-supplier=Digi-Key; ComponentLink4Description: https://datasheet.ciiva.com/855/abmm2-855405.pdf?src-supplier=Digi-Key; ComponentLink5URL: https://datasheet.ciiva.com/855/abmm2-855406.pdf?src-supplier=Digi-Key; ComponentLink5Description: https://datasheet.ciiva.com/855/abmm2-855406.pdf?src-supplier=Digi-Key; ComponentLink6URL: https://datasheet.ciiva.com/855/abmm2-855407.pdf?src-supplier=Digi-Key; ComponentLink6Description: https://datasheet.ciiva.com/855/abmm2-855407.pdf?src-supplier=Digi-Key; Supplier Part Number 1: 1611803
R1-R16 = Resistance
S1 = microswitch: Manufacturer 1: Nidec Copal; Manufacturer Part Number 1: CAS-120TA; Body Material: Polyphenylene; Throw Configuration: SPDT; Voltage Rating (DC): 6V; Current Rating: 100mA; Number of Positions: 2; Electrical Life: 2000Cycles; Max Voltage Rating (DC): 24V; Actuator Type: Slide (Standard); Washable: Yes; Supplier 1: Farnell; Stock 1: 273; Pricing 1: 1=0,95500, 50=0,89700, 100=0,81900, 500=0,74100, 1000=0,62100 (EUR); RoHS: Yes; Mount: Surface Mount; Contact Material: Copper Alloy; Contact Plating: Gold; Min Operating Temperature: -40°C; Max Operating Temperature: 85°C; Packaging: Tape and Reel; Termination: J-Hook; Orientation: Vertical; Length: 0.212inch; Lead Free: Lead Free; ComponentLink1URL: https://datasheet.ciiva.com/2863/cas-2863457.pdf?src-supplier=Digi-Key; ComponentLink1Description: https://datasheet.ciiva.com/2863/cas-2863457.pdf?src-supplier=Digi-Key; ComponentLink2URL: https://datasheet.ciiva.com/2863/cas-2863458.pdf?src-supplier=Digi-Key; ComponentLink2Description: https://datasheet.ciiva.com/2863/cas-2863458.pdf?src-supplier=Digi-Key; ComponentLink3URL: https://datasheet.ciiva.com/2863/cas-2863459.pdf?src-supplier=Digi-Key; ComponentLink3Description: https://datasheet.ciiva.com/2863/cas-2863459.pdf?src-supplier=Digi-Key; Supplier Part Number 1: 2854716
U1 = PI5C3257ZHDEX: Multiplexer/Demultiplexer Bus Switch 4-Channel 2: 1 16-Pin UQFN T/R; Manufacturer 1: Diodes Inc.; Supplier 1: Digi-Key; Manufacturer Part Number 1: PI5C3257ZHDEX; Stock 1: 3500; Pricing 1: 1=0,59000, 10=0,50700, 100=0,37860, 500=0,29744, 1000=0,22984 (USD); Supplier Part Number 1: PI5C3257ZHDEXDICT-ND
U2 = STM32F103C8T6: Manufacturer 1: STMicroelectronics; RAM Size: 20KB; Frequency: 72MHz; Density: 64KB; Number of Bits: 32; Max Power Dissipation: 363mW; Interface: I2C,SPI,USB,CAN,IrDA,UART,USART,LIN; Number of I/Os: 37; Number of Timers/Counters: 4; Max Supply Voltage: 3.6V; Number of PWM Channels: 1; Number of ADC Channels: 10; Min Supply Voltage: 2V; Oscillator Type: Internal; Number of Programmable I/O: 48; Data Bus Width: 32b; Memory Type: FLASH; Number of SPI Channels: 2; Watchdog Timer: Yes; Peripherals: POR,PWM,WDT,DMA,Temp Sensor,I2C; Core Architecture: ARM; Supplier 1: Farnell; Manufacturer Part Number 1: STM32F103C8T6; Stock 1: 3456; Pricing 1: 1=6,01000, 10=4,64000, 25=4,43000, 50=4,22000, 100=4,01000, 250=3,81000, 500=2,88000 (EUR); RoHS: Yes; Case/Package: LQFP; Number of Pins: 48; Min Operating Temperature: -40°C; Max Operating Temperature: 85°C; Packaging: Tray; Package Quantity: 250; Termination: SMD/SMT; Max Frequency: 72MHz; Number of I2C Channels: 2; Address Bus Width: 32b; Memory Size: 64KB; Length: 7mm; Height: 1.45mm; Width: 7.2mm; Radiation Hardening: No; REACH SVHC: No SVHC; Lead Free: Lead Free; ComponentLink1URL: https://datasheet.ciiva.com/15122/getdatasheetpartid-69880-15122076.pdf?src-supplier=Verical; ComponentLink1Description: https://datasheet.ciiva.com/15122/getdatasheetpartid-69880-15122076.pdf?src-supplier=Verical; ComponentLink2URL: https://datasheet.ciiva.com/26816/stm32f103c8t6-26816902.pdf?src-supplier=IIIC; ComponentLink2Description: https://datasheet.ciiva.com/26816/stm32f103c8t6-26816902.pdf?src-supplier=IIIC; ComponentLink3URL: https://datasheet.ciiva.com/16210/cd00161566-16210248.pdf?src-supplier=Future+Electronics; ComponentLink3Description: https://datasheet.ciiva.com/16210/cd00161566-16210248.pdf?src-supplier=Future+Electronics; ComponentLink4URL: https://datasheet.ciiva.com/14100/pustm-arm-microcont-stm32f103-en-14100508.pdf?src-supplier=Distrelec; ComponentLink4Description: https://datasheet.ciiva.com/14100/pustm-arm-microcont-stm32f103-en-14100508.pdf?src-supplier=Distrelec; ComponentLink5URL: https://datasheet.ciiva.com/8054/1730126-8054942.pdf?src-supplier=Element14; ComponentLink5Description: https://datasheet.ciiva.com/8054/1730126-8054942.pdf?src-supplier=Element14; ComponentLink6URL: https://datasheet.ciiva.com/48687/001075658-da-01-en-mcu-64kb-mem-stm32f103c8t6-lqfp-48-stm-48687589.pdf?src-supplier=Conrad; ComponentLink6Description: https://datasheet.ciiva.com/48687/001075658-da-01-en-mcu-64kb-mem-stm32f103c8t6-lqfp-48-stm-48687589.pdf?src-supplier=Conrad; Supplier Part Number 1: 1447637
U3 = USBLC6-2P6: TVS DIODE 5.25V 17V SOT666; Manufacturer 1: STMicroelectronics; Direction: Unidirectional,Bidirectional; Operating Supply Voltage: 5V; Number of Elements: 1; Capacitance: 3.5pF; Reverse Breakdown Voltage: 6V; Number of Channels: 2; Power Line Protection: Yes; Test Current: 1mA; Max Reverse Leakage Current: 150nA; Peak Pulse Current: 5A; Element Configuration: Dual; Supplier 1: Farnell; Manufacturer Part Number 1: USBLC6-2P6; Stock 1: 22255; Pricing 1: 5=0,45800, 50=0,40500, 100=0,24700, 500=0,19100, 1500=0,17700 (EUR); RoHS: Yes; Mount: Surface Mount; Case/Package: SOT-666; Number of Pins: 6; Contact Plating: Tin,Matte; Min Operating Temperature: -40°C; Max Operating Temperature: 125°C; Package Quantity: 1; Packaging: Tape and Reel; Number of Bidirectional Channels: 2; Reverse Standoff Voltage: 5V; Min Breakdown Voltage: 6V; Clamping Voltage: 17V; Polarity: Unidirectional,Bidirectional; Breakdown Voltage: 6V; Termination: SMD/SMT; Working Voltage: 5V; ESD Protection: Yes; Leakage Current: 150nA; Max Breakdown Voltage: 6V; Length: 1.7mm; Height: 0.6mm; Width: 1.3mm; Depth: 1.3mm; Radiation Hardening: No; REACH SVHC: No SVHC; Lead Free: Lead Free; ComponentLink1URL: https://datasheet.ciiva.com/15143/getdatasheetpartid-98673-15143462.pdf?src-supplier=Verical; ComponentLink1Description: https://datasheet.ciiva.com/15143/getdatasheetpartid-98673-15143462.pdf?src-supplier=Verical; ComponentLink2URL: https://datasheet.ciiva.com/14186/usblc6-2-st-eng-tds-14186568.pdf?src-supplier=Distrelec; ComponentLink2Description: https://datasheet.ciiva.com/14186/usblc6-2-st-eng-tds-14186568.pdf?src-supplier=Distrelec; ComponentLink3URL: https://datasheet.ciiva.com/22692/1690354-22692453.pdf?src-supplier=Element14; ComponentLink3Description: https://datasheet.ciiva.com/22692/1690354-22692453.pdf?src-supplier=Element14; ComponentLink4URL: https://datasheet.ciiva.com/22685/1690354-22685832.pdf?src-supplier=Element14; ComponentLink4Description: https://datasheet.ciiva.com/22685/1690354-22685832.pdf?src-supplier=Element14; ComponentLink5URL: https://datasheet.ciiva.com/16378/cd00050750-16378714.pdf?src-supplier=Future+Electronics; ComponentLink5Description: https://datasheet.ciiva.com/16378/cd00050750-16378714.pdf?src-supplier=Future+Electronics; ComponentLink6URL: https://datasheet.ciiva.com/4508/cd00050750-4508892.pdf?src-supplier=Mouser; ComponentLink6Description: https://datasheet.ciiva.com/4508/cd00050750-4508892.pdf?src-supplier=Mouser; ComponentLink7URL: https://datasheet.ciiva.com/41444/001184108-da-01-en-ic-esd-protection-usblc6-2p6-sot-666-stm-41444134.pdf?src-supplier=Conrad; ComponentLink7Description: https://datasheet.ciiva.com/41444/001184108-da-01-en-ic-esd-protection-usblc6-2p6-sot-666-stm-41444134.pdf?src-supplier=Conrad; Supplier Part Number 1: 1295310

## Nets that join several sheets
3.3v: Interface (7 pins), USB_Power (5 pins), LAN (16 pins), WAN (12 pins), Micro (23 pins), Debug (17 pins)
5v: Interface (MIKROBUS_1.10), USB_Power (11 pins), Debug (J6.6 J6.7)
GND: Interface (5 pins), USB_Power (27 pins), LAN (18 pins), WAN (21 pins), Micro (31 pins), Debug (30 pins)
Vbus2: USB_Power (D7.1), Debug (J1.1 U3.5)
CRS: LAN (R37.1), Micro (U12.31)
INT: LAN (R34.2 U4.18), Micro (U12.34)
MDC: LAN (U4.11), Micro (U12.16)
MDIO: LAN (R36.1 U4.10), Micro (U12.24)
NetD3_2: LAN (D3.2), Micro (U12.35)
NetJ2_3: Interface (J2.3 MIKROBUS_1.12 R17.1), Micro (U12.95)
NetJ2_4: Interface (J2.4 MIKROBUS_1.11 R18.1), Micro (U12.96)
NetJ2_8: Interface (J2.8 R30.2), Micro (U12.29)
NetJ2_17: Interface (J2.17), Micro (U12.2)
NetJ2_18: Interface (J2.18), Micro (U12.7)
NetMIKROBUS_1_1: Interface (MIKROBUS_1.1), Micro (U12.18)
NetMIKROBUS_1_2: Interface (MIKROBUS_1.2), Micro (U12.83)
NetMIKROBUS_1_3: Interface (MIKROBUS_1.3), Micro (U12.85)
NetMIKROBUS_1_4: Interface (MIKROBUS_1.4), Micro (U12.89)
NetMIKROBUS_1_5: Interface (MIKROBUS_1.5), Micro (U12.90)
NetMIKROBUS_1_6: Interface (MIKROBUS_1.6), Micro (U12.91)
NetMIKROBUS_1_13: Interface (MIKROBUS_1.13), Micro (U12.87)
NetMIKROBUS_1_14: Interface (MIKROBUS_1.14), Micro (U12.86)
NetMIKROBUS_1_15: Interface (MIKROBUS_1.15), Micro (U12.84)
NetMIKROBUS_1_16: Interface (MIKROBUS_1.16), Micro (U12.67)
NetR19_1: Interface (R19.1), Micro (U12.93)
NetR20_2: Interface (R20.2), Micro (U12.28)
NetR21_1: Interface (R21.1), Micro (U12.30)
NetR22_1: Interface (R22.1), Micro (U12.5)
NetR23_2: Interface (R23.2), Micro (U12.4)
NetR24_1: Interface (R24.1), Micro (U12.92)
NetR25_2: Interface (R25.2), Micro (U12.3)
NetR26_1: Interface (R26.1), Micro (U12.98)
NetR27_2: Interface (R27.2), Micro (U12.97)
NetR28_1: Interface (R28.1), Micro (U12.69)
NetR29_2: Interface (R29.2), Micro (U12.68)
NetR61_1: WAN (R61.1 U10.32), Micro (U12.78)
NetR62_1: WAN (R62.1 U10.3), Micro (U12.79)
NetR63_2: WAN (R63.2), Micro (U12.81)
NetR65_2: WAN (R65.2), Micro (U12.94)
NetU10_11: WAN (U10.11), Micro (U12.58)
NetU10_12: WAN (U10.12), Micro (U12.53)
REF_CLK: LAN (U4.16), Micro (U12.23)
RST1: WAN (R64.2), Micro (C28.2 R49.1 U12.14), Debug (J6.1 U1.11)
RST2: WAN (C61.2 R66.2 U10.25), Micro (R51.1), Debug (J6.12 U1.10)
RXD0: LAN (R40.2), Micro (U12.51)
RXD1: LAN (R38.1), Micro (U12.52)
SWCLK1: Micro (U12.76), Debug (J6.2 U1.5)
SWCLK2: WAN (U10.2), Debug (J6.11 U1.6)
SWDIO1: Micro (U12.72), Debug (J6.3 U1.2)
SWDIO2: WAN (U10.1), Debug (J6.10 U1.3)
TXD0: LAN (R33.1), Micro (U12.32)
TXD1: LAN (R32.1), Micro (U12.33)
TXEN: LAN (R35.1), Micro (U12.47)
USB_COM_N: USB_Power (R52.2), Micro (U12.70)
USB_COM_P: USB_Power (R53.2), Micro (U12.71)